# Altium schematic sheet Peripheral_copy.SchDoc
size A2; SheetNumber: 2; SheetTotal: 3
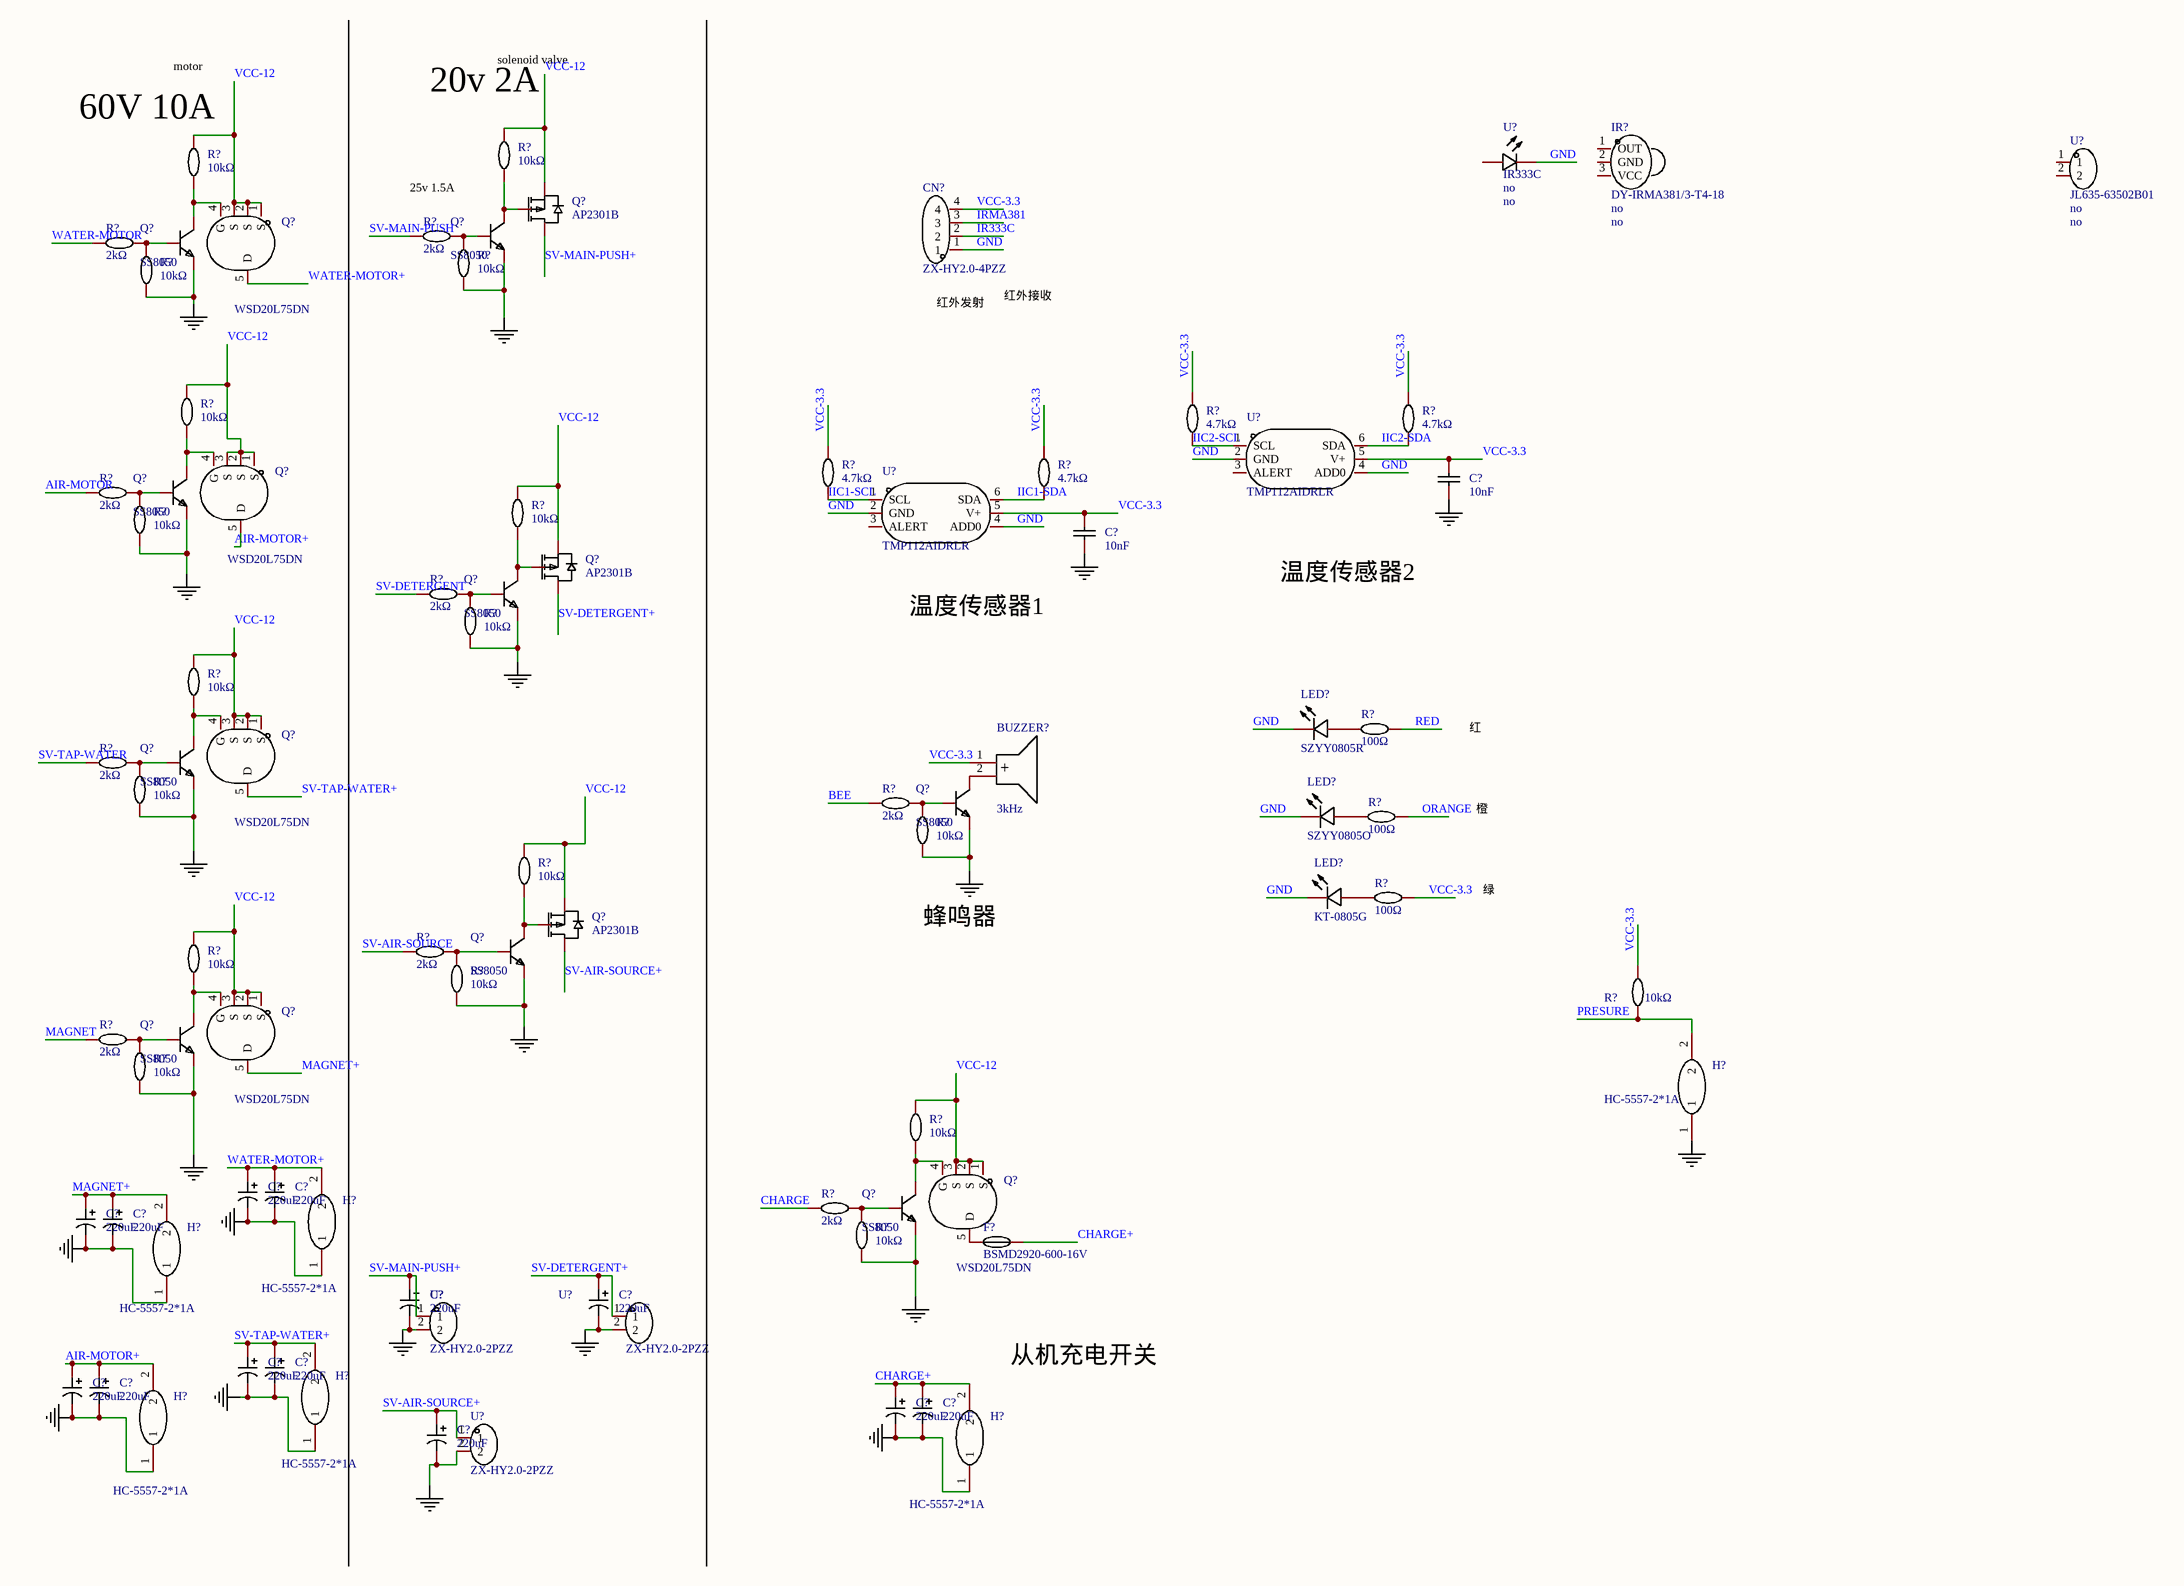
[diagram p0: Peripheral_copy.SchDoc]

## Parts
(Parts that share a designator on the sheet are numbered #1, #2 ... from top to bottom, then left to right.)
BUZZER?  3kHz  [BUZ-TH_BD9.0-P5.00-D0.6-FD]
C?#1  10nF  [C0603]
C?#2  10nF  [C0603]
C?#3  220uF  [CAP-SMD_BD6.3-L6.6-W6.6-LS7.4-FD]
C?#4  220uF  [CAP-SMD_BD6.3-L6.6-W6.6-LS7.4-FD]
C?#5  220uF  [CAP-SMD_BD6.3-L6.6-W6.6-LS7.4-FD]
C?#6  220uF  [CAP-SMD_BD6.3-L6.6-W6.6-LS7.4-FD]
C?#7  220uF  [CAP-SMD_BD6.3-L6.6-W6.6-LS7.4-FD]
C?#8  220uF  [CAP-SMD_BD6.3-L6.6-W6.6-LS7.4-FD]
C?#9  220uF  [CAP-SMD_BD6.3-L6.6-W6.6-LS7.4-FD]
C?#10  220uF  [CAP-SMD_BD6.3-L6.6-W6.6-LS7.4-FD]
C?#11  220uF  [CAP-SMD_BD6.3-L6.6-W6.6-LS7.4-FD]
C?#12  220uF  [CAP-SMD_BD6.3-L6.6-W6.6-LS7.4-FD]
C?#13  220uF  [CAP-SMD_BD6.3-L6.6-W6.6-LS7.4-FD]
C?#14  220uF  [CAP-SMD_BD6.3-L6.6-W6.6-LS7.4-FD]
C?#15  220uF  [CAP-SMD_BD6.3-L6.6-W6.6-LS7.4-FD]
CN?  ZX-HY2.0-4PZZ  [CONN-TH_4P-P2.00_HX20020-4A_2]
F?  BSMD2920-600-16V  [F2920]
H?#1  HC-5557-2*1A  [CONN-TH_HAA420A-2A]
H?#2  HC-5557-2*1A  [CONN-TH_HAA420A-2A]
H?#3  HC-5557-2*1A  [CONN-TH_HAA420A-2A]
H?#4  HC-5557-2*1A  [CONN-TH_HAA420A-2A]
H?#5  HC-5557-2*1A  [CONN-TH_HAA420A-2A]
H?#6  HC-5557-2*1A  [CONN-TH_HAA420A-2A]
IR?  Add into BOM: no  [OPTO-SMD_3P-L5.0-W5.0-P1.27-LS8.5]  (hidden comment: DY-IRMA381/3-T4-18)
LED?#1  SZYY0805R  [LED0805-R-RD]
LED?#2  SZYY0805O  [LED0805-R-RD_ORANGE]
LED?#3  KT-0805G  [LED0805-R-RD]
Q?#1  AP2301B  [SOT-23-3_L2.9-W1.3-P1.90-LS2.4-TR]
Q?#2  SS8050  [SOT-23-3_L2.9-W1.3-P1.90-LS2.4-BR]
Q?#3  SS8050  [SOT-23-3_L2.9-W1.3-P1.90-LS2.4-BR]
Q?#4  WSD20L75DN  [DFN-8_L3.3-W3.3-P0.65-BL_WSD20L75DN]
Q?#5  SS8050  [SOT-23-3_L2.9-W1.3-P1.90-LS2.4-BR]
Q?#6  WSD20L75DN  [DFN-8_L3.3-W3.3-P0.65-BL_WSD20L75DN]
Q?#7  AP2301B  [SOT-23-3_L2.9-W1.3-P1.90-LS2.4-TR]
Q?#8  SS8050  [SOT-23-3_L2.9-W1.3-P1.90-LS2.4-BR]
Q?#9  WSD20L75DN  [DFN-8_L3.3-W3.3-P0.65-BL_WSD20L75DN]
Q?#10  SS8050  [SOT-23-3_L2.9-W1.3-P1.90-LS2.4-BR]
Q?#11  SS8050  [SOT-23-3_L2.9-W1.3-P1.90-LS2.4-BR]
Q?#12  AP2301B  [SOT-23-3_L2.9-W1.3-P1.90-LS2.4-TR]
Q?#13  SS8050  [SOT-23-3_L2.9-W1.3-P1.90-LS2.4-BR]
Q?#14  WSD20L75DN  [DFN-8_L3.3-W3.3-P0.65-BL_WSD20L75DN]
Q?#15  SS8050  [SOT-23-3_L2.9-W1.3-P1.90-LS2.4-BR]
Q?#16  WSD20L75DN  [DFN-8_L3.3-W3.3-P0.65-BL_WSD20L75DN]
Q?#17  SS8050  [SOT-23-3_L2.9-W1.3-P1.90-LS2.4-BR]
R?#1  10kΩ  [R0603]
R?#2  10kΩ  [R0603]
R?#3  2kΩ  [R0603]
R?#4  2kΩ  [R0603]
R?#5  10kΩ  [R0603]
R?#6  10kΩ  [R0603]
R?#7  10kΩ  [R0603]
R?#8  4.7kΩ  [R0603]
R?#9  4.7kΩ  [R0603]
R?#10  4.7kΩ  [R0603]
R?#11  4.7kΩ  [R0603]
R?#12  2kΩ  [R0603]
R?#13  10kΩ  [R0603]
R?#14  10kΩ  [R0603]
R?#15  2kΩ  [R0603]
R?#16  10kΩ  [R0603]
R?#17  10kΩ  [R0603]
R?#18  100Ω  [R0603]
R?#19  2kΩ  [R0603]
R?#20  10kΩ  [R0603]
R?#21  2kΩ  [R0603]
R?#22  100Ω  [R0603]
R?#23  10kΩ  [R0603]
R?#24  10kΩ  [R0603]
R?#25  100Ω  [R0603]
R?#26  2kΩ  [R0603]
R?#27  10kΩ  [R0603]
R?#28  10kΩ  [R0603]
R?#29  10kΩ  [R0603]
R?#30  2kΩ  [R0603]
R?#31  10kΩ  [R0603]
R?#32  10kΩ  [R0603]
R?#33  2kΩ  [R0603]
R?#34  10kΩ  [R0603]
U?#1  Add into BOM: no  [LED-TH_BD5.0-P2.54-FD]  (hidden comment: IR333C)
U?#2  Add into BOM: no  [CONN-TH_JL635-63502B01]  (hidden comment: JL635-63502B01)
U?#3  TMP112AIDRLR  [SOT-563_L1.6-W1.2-P0.50-LS1.6-BR]
U?#4  TMP112AIDRLR  [SOT-563_L1.6-W1.2-P0.50-LS1.6-BR]
U?#5  ZX-HY2.0-2PZZ  [CONN-TH_2P-P2.00_ZX-HY2.0-2PZZ]
U?#6  ZX-HY2.0-2PZZ  [CONN-TH_2P-P2.00_ZX-HY2.0-2PZZ]
U?#7  ZX-HY2.0-2PZZ  [CONN-TH_2P-P2.00_ZX-HY2.0-2PZZ]

## Nets
GND: C?#1.1 C?#2.1 C?#3.2 C?#4.2 C?#5.2 C?#6.2 C?#7.2 C?#8.2 C?#9.2 C?#10.2 C?#11.2 C?#12.2 C?#13.2 C?#14.2 C?#15.2 CN?.1 H?#1.1 H?#2.1 H?#3.1 H?#4.1 H?#5.1 H?#6.1 LED?#1.2(-) LED?#2.2(-) LED?#3.2(K) Q?#2.2(E) Q?#3.2(E) Q?#5.2(E) Q?#8.2(E) Q?#10.2(E) Q?#11.2(E) Q?#13.2(E) Q?#15.2(E) Q?#17.2(E) R?#5.2 R?#6.2 R?#14.2 R?#16.2 R?#20.2 R?#23.2 R?#28.2 R?#31.2 R?#34.2 U?#1.2(C) U?#3.2(GND) U?#3.4(ADD0) U?#4.2(GND) U?#4.4(ADD0) U?#5.2 U?#6.2 U?#7.2
AIR-MOTOR: R?#12.1
AIR-MOTOR+: C?#11.1 C?#12.1 H?#5.2 Q?#6.5(D)
BEE: R?#21.1
CHARGE: R?#33.1
CHARGE+: C?#13.1 C?#14.1 F?.2 H?#6.2
IIC1-SCL: R?#10.1 U?#4.1(SCL)
IIC1-SDA: R?#11.1 U?#4.6(SDA)
IIC2-SCL: R?#8.1 U?#3.1(SCL)
IIC2-SDA: R?#9.1 U?#3.6(SDA)
IR333C: CN?.2
IRMA381: CN?.3
MAGNET: R?#30.1
MAGNET+: C?#5.1 C?#6.1 H?#3.2 Q?#14.5(D)
ORANGE: R?#22.2
PRESURE: H?#1.2 R?#29.1
RED: R?#18.2
SV-AIR-SOURCE: R?#26.1
SV-AIR-SOURCE+: C?#15.1 Q?#12.3(D) U?#7.1
SV-DETERGENT: R?#15.1
SV-DETERGENT+: C?#8.1 Q?#7.3(D) U?#6.1
SV-MAIN-PUSH: R?#3.1
SV-MAIN-PUSH+: C?#7.1 Q?#1.3(D) U?#5.1
SV-TAP-WATER: R?#19.1
SV-TAP-WATER+: C?#9.1 C?#10.1 H?#4.2 Q?#9.5(D)
VCC-3.3: BUZZER?.1(+) C?#1.2 C?#2.2 CN?.4 R?#8.2 R?#9.2 R?#10.2 R?#11.2 R?#25.2 R?#29.2 U?#3.5(V+) U?#4.5(V+)
VCC-12: Q?#1.1(S) Q?#4.1(S) Q?#4.2(S) Q?#4.3(S) Q?#6.1(S) Q?#6.2(S) Q?#6.3(S) Q?#7.1(S) Q?#9.1(S) Q?#9.2(S) Q?#9.3(S) Q?#12.1(S) Q?#14.1(S) Q?#14.2(S) Q?#14.3(S) Q?#16.1(S) Q?#16.2(S) Q?#16.3(S) R?#1.1 R?#2.1 R?#7.1 R?#13.1 R?#17.1 R?#24.1 R?#27.1 R?#32.1
WATER-MOTOR: R?#4.1
WATER-MOTOR+: C?#3.1 C?#4.1 H?#2.2 Q?#4.5(D)
NetBUZZER?_2: BUZZER?.2(-) Q?#11.3(C)
NetF?_1: F?.1 Q?#16.5(D)
NetLED?#1_1: LED?#1.1(+) R?#18.1
NetLED?#2_1: LED?#2.1(+) R?#22.1
NetLED?#3_1: LED?#3.1(A) R?#25.1
NetQ?#1_2: Q?#1.2(G) Q?#2.3(C) R?#1.2
NetQ?#2_1: Q?#2.1(B) R?#3.2 R?#5.1
NetQ?#3_1: Q?#3.1(B) R?#4.2 R?#6.1
NetQ?#3_3: Q?#3.3(C) Q?#4.4(G) R?#2.2
NetQ?#5_1: Q?#5.1(B) R?#12.2 R?#14.1
NetQ?#5_3: Q?#5.3(C) Q?#6.4(G) R?#7.2
NetQ?#7_2: Q?#7.2(G) Q?#8.3(C) R?#13.2
NetQ?#8_1: Q?#8.1(B) R?#15.2 R?#16.1
NetQ?#9_4: Q?#9.4(G) Q?#10.3(C) R?#17.2
NetQ?#10_1: Q?#10.1(B) R?#19.2 R?#20.1
NetQ?#11_1: Q?#11.1(B) R?#21.2 R?#23.1
NetQ?#12_2: Q?#12.2(G) Q?#13.3(C) R?#24.2
NetQ?#13_1: Q?#13.1(B) R?#26.2 R?#28.1
NetQ?#14_4: Q?#14.4(G) Q?#15.3(C) R?#27.2
NetQ?#15_1: Q?#15.1(B) R?#30.2 R?#31.1
NetQ?#16_4: Q?#16.4(G) Q?#17.3(C) R?#32.2
NetQ?#17_1: Q?#17.1(B) R?#33.2 R?#34.1

Not connected (* = marked no-connect by the designer): IR? 1(OUT) 2(GND) 3(VCC); U?#1 1(A); U?#2 1 2; U?#3 3(ALERT); U?#4 3(ALERT)

## Notes on the sheet
- solenoid valve
- (near R?#2) 60V 10A
- motor
- (near R?#1) 20v 2A
- 25v 1.5A
- (near CN?) 红外发射
- 红外接收
- 温度传感器2
- 温度传感器1
- 红
- 橙
- 蜂鸣器
- 绿
- 从机充电开关

## Library data of the parts
BUZZER? = HNB09A03: Manufacturer: 华能; Add into BOM: yes; Oscillator Circuit: 有源(内含驱动线路); Technology Type: 电磁式; Operating Voltage: 1.5V~4.5V; Current Consumption: 30mA; Sound Pressure Level (SPL): 85dB@10cm; Name: 3kHz; Symbol: HNB09A03; Device: HNB09A03; Supplier: LCSC; Supplier Part: C96102; Manufacturer Part: HNB09A03; JLCPCB Part Class: 扩展库; Value: 3kHz; LCSC Part Name: 电磁式有源一体蜂鸣器HNB09A03; Supplier Footprint: 插件,D=9mm; Datasheet: https://atta.szlcsc.com/upload/public/pdf/source/20170522/1495448326172.pdf; Convert to PCB: yes; Diameter (φD): 9mm; Length: -; Width: -; Height: 5.5mm; Operating Temperature: -20℃~+70℃
C?#1 C?#2 = CC0603KRX7R9BB103: Manufacturer: YAGEO(国巨); Add into BOM: yes; Tolerance: ±10%; Voltage Rated: 50V; Temperature Coefficient: X7R; Name: 10nF; Symbol: CC0603KRX7R9BB103; Device: CC0603KRX7R9BB103; Supplier: LCSC; Manufacturer Part: CC0603KRX7R9BB103; Value: 10nF; Supplier Part: C100042; JLCPCB Part Class: 扩展库; LCSC Part Name: 10nF ±10% 50V; Supplier Footprint: 0603; Datasheet: https://atta.szlcsc.com/upload/public/pdf/source/20181008/C309510_22F155564471FAF6A489F7D68F34234E.pdf; Convert to PCB: yes
C?#3-C?#15 = RVT1E221M0607: Manufacturer: ROQANG(容强); Symbol: RVT1E221M0607_C2918361; Add into BOM: yes; Tolerance: ±20%; Rated Voltage: 25V; Ripple Current: 150mA@120Hz; φD: 6.3mm; L: 7.7mm; Lifetime @ Temp: 2000hrs@105℃; Name: 220uF; Device: RVT1E221M0607; Supplier: LCSC; Supplier Part: C2918361; Manufacturer Part: RVT1E221M0607; Value: 220uF; JLCPCB Part Class: 扩展库; LCSC Part Name: 220uF ±20% 25V; Supplier Footprint: SMD,D6.3xL7.7mm; Datasheet: https://atta.szlcsc.com/upload/public/pdf/source/20211118/497C0614266278696CA52BDF245B991F.pdf; Convert to PCB: yes; Equivalent Series Resistance(ESR): -; Operating Temperature: -40℃~+105℃
CN? = ZX-HY2.0-4PZZ: Manufacturer: Megastar(兆星); Add into BOM: yes; Pins Structure: 1x4P; Pitch: 2mm; Reference Series: HY; Number of PINs Per Row: 4; Current Rating (Max): 2A; Name: ZX-HY2.0-4PZZ; Symbol: ZX-HY2.0-4PZZ; Device: ZX-HY2.0-4PZZ; LCSC Part Name: 1x4P 间距:2mm 直插 系列:HY; Supplier Part: C7429580; Manufacturer Part: ZX-HY2.0-4PZZ; Supplier Footprint: 插件,P=2mm; JLCPCB Part Class: 扩展库; Datasheet: https://atta.szlcsc.com/upload/public/pdf/source/20230619/44026E9B0BFE007E57437F997C730D91.pdf; Supplier: LCSC; Convert to PCB: yes; Mounting Style: 直插; Number of Pins: 4P; Number of Rows: 1; Row Spacing: -; Contact Material: 黄铜; Contact Plating: 锡; Operating Temperature Range: -25℃~+85℃
F? = BSMD2920-600-16V: Manufacturer: BHFUSE(佰宏); Add into BOM: yes; Operating Voltage (Max): 16V; Current Rating (Max): 40A; Hold Current: 6A; Trip Current: 12A; Power Dissipation: 2W; Resistance - Initial (Ri) (Min): 4mΩ; Resistance - Post Trip (R1) (Max): 20mΩ; Maximum Time to Trip: 6s; Name: BSMD2920-600-16V; Symbol: BSMD2920-600-16V; Device: BSMD2920-600-16V; Supplier: LCSC; Supplier Part: C910847; Manufacturer Part: BSMD2920-600-16V; JLCPCB Part Class: 扩展库; LCSC Part Name: 2920 6A 16V 佰宏大电流; Supplier Footprint: 2920; Datasheet: https://atta.szlcsc.com/upload/public/pdf/source/20230512/D022CCFE0A7F15633C929F419B252442.pdf; Convert to PCB: yes; Operating Temperature: -40℃~+85℃
H?#1-H?#6 = HC-5557-2*1A: Manufacturer: HCTL(华灿天禄); Add into BOM: yes; Pins Structure: 2x1P; Pitch: 4.2mm; Number of PINs Per Row: 1; Current Rating (Max): 9A; Name: HC-5557-2*1A; Symbol: HC-5557-2*1A; Device: HC-5557-2*1A; LCSC Part Name: 2x1P 间距:4.2mm 直插; Supplier Part: C2845776; Manufacturer Part: HC-5557-2*1A; Supplier Footprint: 插件,P=4.2mm; JLCPCB Part Class: 扩展库; Datasheet: https://atta.szlcsc.com/upload/public/pdf/source/20230620/FF5B1F4AE343F4430EEB0EA0134778E8.pdf; Supplier: LCSC; Convert to PCB: yes; Mounting Style: 直插; Reference Series: -; Number of Pins: 2P; Number of Rows: 2; Row Spacing: 4.2mm; Contact Material: 黄铜; Contact Plating: 锡; Operating Temperature Range: -25℃~+85℃
IR? = DY-IRMA381/3-T4-18: Manufacturer: TONYU(东裕); Supply Voltage: 2.7V~5.5V; Transmission Distance: 15m; Center Frequency: 38Hz; Half Angle: ±45°; Name: DY-IRMA381/3-T4-18; Symbol: DY-IRMA381/3-T4-18; Device: DY-IRMA381/3-T4-18; LCSC Part Name: DY-IRMA381/3-T4-18; Supplier Part: C7433073; Manufacturer Part: DY-IRMA381/3-T4-18; Supplier Footprint: SIP-3-2.54mm; JLCPCB Part Class: Extended Part; Datasheet: https://atta.szlcsc.com/upload/public/pdf/source/20230626/F44F0C86DC4148D3A257F2F238F6B37C.pdf; Supplier: LCSC; Convert to PCB: no; Supply Current: -; Power Consumption: -; Operating Temperature: -20℃~+70℃
LED?#1 = SZYY0805R: Manufacturer: yongyu(永裕光电); Add into BOM: yes; Emitted Color: 红色; Power Dissipation: 40mW; Forward Current: 10mA; Dominant Wavelength: 615nm~630nm; Peak Wavelength: 645nm; Lens Color: 无色透明透镜; Viewing Angle: 120°; Name: SZYY0805R; Symbol: SZYY0805R; Device: SZYY0805R; LCSC Part Name: 红灯; Supplier Part: C434431; Manufacturer Part: SZYY0805R; Supplier Footprint: 0805; JLCPCB Part Class: 扩展库; Datasheet: https://atta.szlcsc.com/upload/public/pdf/source/20191204/C434431_431C171B758FE4C37FA40B1B295AA7AB.pdf; Supplier: LCSC; Convert to PCB: yes; Diode Configuration: -; Color Temperature: -; Mounting Sytle: -; Operating Temperature: -40℃~+85℃
LED?#2 = SZYY0805O: Manufacturer: yongyu(永裕光电); Add into BOM: yes; Emitted Color: 橙色; Power Dissipation: 40mW; Forward Current: 10mA; Dominant Wavelength: 598nm~608nm; Peak Wavelength: 612nm; Lens Color: 无色透明透镜; Viewing Angle: 120°; Name: SZYY0805O; Symbol: SZYY0805O; Device: SZYY0805O; LCSC Part Name: 橙灯; Supplier Part: C434437; Manufacturer Part: SZYY0805O; Supplier Footprint: 0805; JLCPCB Part Class: 扩展库; Datasheet: https://atta.szlcsc.com/upload/public/pdf/source/20191204/C434437_FEEE55121CE44A7B51FF65143D720449.pdf; Supplier: LCSC; Convert to PCB: yes; Diode Configuration: -; Color Temperature: -; Mounting Sytle: -; Operating Temperature: -40℃~+85℃
LED?#3 = KT-0805G: Manufacturer: KENTO; Symbol: 0805G (Green); Add into BOM: yes; Emitted Color: 翠绿色; Name: KT-0805G; Device: KT-0805G; LCSC Part Name: 0805 翠绿 高亮; Supplier Part: C2297; Manufacturer Part: KT-0805G; Supplier Footprint: 0805; JLCPCB Part Class: 基础库; Datasheet: https://atta.szlcsc.com/upload/public/pdf/source/20170209/1486607340485.pdf; Supplier: LCSC; Convert to PCB: yes; Lamp Holder Type: -; Forward Voltage (VF): -; Power Dissipation: -; Forward Current: -; Dominant Wavelength: -; Peak Wavelength: -; Diode Configuration: -; Lens Color: -; Color Temperature: -; Luminous Intensity: -; Viewing Angle: -; Mounting Sytle: -; Operating Temperature: -
Q?#1 Q?#7 Q?#12 = AP2301B: Manufacturer: ALLPOWER(铨力); Add into BOM: yes; Type: P沟道; Drain Source Voltage (Vdss): 20V; Continuous Drain Current (Id): 2A; Power Dissipation (Pd): 750mW; Drain Source On Resistance (RDS(on)@Vgs,Id): 130mΩ@4.5V,2A; Gate Threshold Voltage (Vgs(th)@Id): 950mV@250uA; Input Capacitance (Ciss@Vds): 210pF@6V; Reverse Transfer Capacitance (Crss@Vds): 27pF@6V; Name: AP2301B; Symbol: AP2301B; Device: AP2301B; LCSC Part Name: P沟道 耐压:20V 电流:2A; Supplier Part: C2763847; Manufacturer Part: AP2301B; Supplier Footprint: SOT-23; JLCPCB Part Class: 扩展库; Datasheet: https://atta.szlcsc.com/upload/public/pdf/source/20210401/C2763847_842F2A0FFE6F1F01F619022F78C12F29.pdf; Supplier: LCSC; Convert to PCB: yes; Total Gate Charge (Qg@Vgs): -
Q?#2 Q?#3 Q?#5 Q?#8 Q?#10 Q?#11 Q?#13 Q?#15 Q?#17 = SS8050_C2150: Manufacturer: CJ(江苏长电/长晶); Add into BOM: yes; Transistor Type: NPN; Collector Current (Ic): 1.5A; Collector-Emitter Breakdown Voltage (Vceo): 25V; Power Dissipation (Pd): 300mW; DC Current Gain (hFE@Ic,Vce): 200@100mA,1V; Transition Frequency (fT): 100MHz; Collector Cut-Off Current (Icbo): 100nA; Collector-Emitter Saturation Voltage (VCE(sat)@Ic,Ib): 500mV@800mA,80mA; Name: SS8050; Symbol: SS8050_C2150; Device: SS8050_C2150; LCSC Part Name: SS8050(RANGE:200-350) hfe=200~350; Supplier Part: C2150; Manufacturer Part: SS8050; Supplier Footprint: SOT-23; JLCPCB Part Class: 基础库; Datasheet: https://atta.szlcsc.com/upload/public/pdf/source/20230322/AEE86F4B043774EFF80CAEA14A37D9E9.pdf; Supplier: LCSC; Convert to PCB: yes; Operating Temperature: -
Q?#4 Q?#6 Q?#9 Q?#14 Q?#16 = WSD20L75DN: Manufacturer: WINSOK(微硕); Add into BOM: yes; Type: 1个P沟道; Drain Source Voltage (Vdss): 20V; Continuous Drain Current (Id): 75A; Power Dissipation (Pd): 83W; Drain Source On Resistance (RDS(on)@Vgs,Id): 6mΩ@4.5V,20A; Gate Threshold Voltage (Vgs(th)@Id): 1V@250uA; Name: WSD20L75DN; Symbol: WSD20L75DN; Device: WSD20L75DN; LCSC Part Name: 1个P沟道 耐压:20V 电流:75A; Supplier Part: C148391; Manufacturer Part: WSD20L75DN; Supplier Footprint: DFN-8(3.3x3.3); JLCPCB Part Class: 扩展库; Datasheet: https://atta.szlcsc.com/upload/public/pdf/source/20171122/C148391_15113333998001134036.pdf; Supplier: LCSC; Convert to PCB: yes
R?#1 R?#2 R?#5-R?#7 R?#13 R?#14 R?#16 R?#17 R?#20 R?#23 R?#24 R?#27-R?#29 R?#31 R?#32 R?#34 = 0603WAF1002T5E: Manufacturer: UNI-ROYAL(厚声); Add into BOM: yes; Tolerance: ±1%; Power(Watts): 100mW; Overload Voltage (Max): 75V; Temperature Coefficient: ±100ppm/℃; Name: 10kΩ; Symbol: 0603WAF1002T5E; Device: 0603WAF1002T5E; Supplier: LCSC; Manufacturer Part: 0603WAF1002T5E; Supplier Part: C25804; Value: 10kΩ; JLCPCB Part Class: 基础库; LCSC Part Name: 厚膜电阻 10kΩ ±1% 100mW; Supplier Footprint: 0603; Datasheet: https://atta.szlcsc.com/upload/public/pdf/source/20200306/C422600_1E6D84923E4A46A82E41ADD87F860B5C.pdf; Convert to PCB: yes; Type: 厚膜电阻; Operating Temperature Range: -55℃~+155℃
R?#3 R?#4 R?#12 R?#15 R?#19 R?#21 R?#26 R?#30 R?#33 = 0603WAF2001T5E: Manufacturer: UNI-ROYAL(厚声); Add into BOM: yes; Tolerance: ±1%; Power(Watts): 100mW; Overload Voltage (Max): 75V; Temperature Coefficient: ±100ppm/℃; Name: 2kΩ; Symbol: 0603WAF2001T5E; Device: 0603WAF2001T5E; LCSC Part Name: 2kΩ ±1% 100mW 厚膜电阻; Supplier Part: C22975; Manufacturer Part: 0603WAF2001T5E; Supplier Footprint: 0603; JLCPCB Part Class: 基础库; Datasheet: https://atta.szlcsc.com/upload/public/pdf/source/20200306/C422600_1E6D84923E4A46A82E41ADD87F860B5C.pdf; Supplier: LCSC; Convert to PCB: yes; Type: 厚膜电阻; Value: 2kΩ; Operating Temperature Range: -55℃~+155℃
R?#8-R?#11 = RC0603FR-074K7L: Manufacturer: YAGEO(国巨); Add into BOM: yes; Tolerance: ±1%; Power(Watts): 100mW; Overload Voltage (Max): 75V; Temperature Coefficient: ±100ppm/℃; Name: 4.7kΩ; Symbol: RC0603FR-074K7L; Device: RC0603FR-074K7L; LCSC Part Name: 厚膜电阻 4.7kΩ ±1% 100mW; Supplier Part: C99782; Manufacturer Part: RC0603FR-074K7L; Supplier Footprint: 0603; JLCPCB Part Class: 扩展库; Datasheet: https://atta.szlcsc.com/upload/public/pdf/source/20180224/C181757_15194369480721363983.pdf; Supplier: LCSC; Convert to PCB: yes; Type: 厚膜电阻; Value: 4.7kΩ; Operating Temperature Range: -55℃~+155℃
R?#18 R?#22 R?#25 = 0603WAF1000T5E: Manufacturer: UNI-ROYAL(厚声); Add into BOM: yes; Tolerance: ±1%; Power(Watts): 100mW; Overload Voltage (Max): 75V; Temperature Coefficient: ±200ppm/℃; Name: 100Ω; Symbol: 0603WAF1000T5E; Device: 0603WAF1000T5E; LCSC Part Name: 100Ω ±1% 100mW 厚膜电阻; Supplier Part: C22775; Manufacturer Part: 0603WAF1000T5E; Supplier Footprint: 0603; JLCPCB Part Class: 基础库; Datasheet: https://atta.szlcsc.com/upload/public/pdf/source/20200306/C422600_1E6D84923E4A46A82E41ADD87F860B5C.pdf; Supplier: LCSC; Convert to PCB: yes; Type: 厚膜电阻; Value: 100Ω; Operating Temperature Range: -55℃~+155℃
U?#1 = IR333C: Manufacturer: EVERLIGHT(亿光); Vf - Forward Voltage: 1.2V; Wavelength: 940nm; Radiant Intensity: 7.8mW/sr@20mA; View Angle: 20°; Name: IR333C; Symbol: IR333C; Device: IR333C; LCSC Part Name: 5mm红外LED; Supplier Part: C5200795; Manufacturer Part: IR333C; Supplier Footprint: 插件; JLCPCB Part Class: 扩展库; Datasheet: https://atta.szlcsc.com/upload/public/pdf/source/20221214/25ED07650BA98783E37095EC49136A18.pdf; Supplier: LCSC; Convert to PCB: no; Operating Temperature: -40℃~+85℃
U?#2 = JL635-63502B01: Manufacturer: JILN(锦凌); Barrier Type: 三面; Pitch: 6.35mm; Structure: 1x2P; Pin Location: 边脚; Current Rating (Max): 20A; Voltage Rating (Max): 300V; Wire Gauge - AWG: 16~22; Number of PINs Per Row: 2; Name: JL635-63502B01; Symbol: JL635-63502B01; Device: JL635-63502B01; LCSC Part Name: 6.35mm 1x2P 每排P数:2 排数:1 直针 边脚; Supplier Part: C409150; Manufacturer Part: JL635-63502B01; Supplier Footprint: 插件,P=6.35mm; JLCPCB Part Class: 扩展库; Datasheet: https://atta.szlcsc.com/upload/public/pdf/source/20190822/C409152_595F95B6E947962A78FA133625F1EF84.pdf; Supplier: LCSC; Convert to PCB: no; Mounting Style: 直针; Number of Pins: 2P; Number of Rows: 1; Wire Gauge - mm2: -; Operating Temperature Range: -40℃~+105℃; Color: 黑色
U?#3 U?#4 = TMP112AIDRLR: Manufacturer: TI(德州仪器); Add into BOM: yes; Resolution: 0.5℃; Supply Voltage: 1.4V~3.6V; Standby Current: 1uA; Interface Type: I2C; Name: TMP112AIDRLR; Symbol: TMP112AIDRLR; Device: TMP112AIDRLR; LCSC Part Name: TMP112AIDRLR; Supplier Part: C28927; Manufacturer Part: TMP112AIDRLR; Supplier Footprint: SOT-563; JLCPCB Part Class: 扩展库; Datasheet: https://www.ti.com/cn/lit/gpn/tmp112; Supplier: LCSC; Convert to PCB: yes; Temperature range: -40℃~+125℃
U?#5-U?#7 = ZX-HY2.0-2PZZ: Manufacturer: Megastar(兆星); Add into BOM: yes; Pins Structure: 1x2P; Pitch: 2mm; Reference Series: HY; Number of PINs Per Row: 2; Current Rating (Max): 2A; Name: ZX-HY2.0-2PZZ; Symbol: ZX-HY2.0-2PZZ; Device: ZX-HY2.0-2PZZ; LCSC Part Name: 1x2P 间距:2mm 直插 系列:HY; Supplier Part: C7429578; Manufacturer Part: ZX-HY2.0-2PZZ; Supplier Footprint: 插件,P=2mm; JLCPCB Part Class: 扩展库; Datasheet: https://atta.szlcsc.com/upload/public/pdf/source/20230619/DEC43A5E9BAFB7A5BDB16FEDBE15E2A0.pdf; Supplier: LCSC; Convert to PCB: yes; Mounting Style: 直插; Number of Pins: 2P; Number of Rows: 1; Row Spacing: -; Contact Material: 黄铜; Contact Plating: 锡; Operating Temperature Range: -25℃~+85℃